# Altium schematic sheet MB1209.SchDoc: MB1209-TOP
size A3; Date: 3/31/2015; Author: P.A.; CompanyName: STMicroelectronics; Organization: Microcontrollers Division; Address1: 12, Rue Jules HOROWITZ; Address2: 38019 Grenoble; Address3: FRANCE; DocumentNumber: MB1209; Revision: D-02; SheetNumber: 1; SheetTotal: 11; Project: STM32F412G-DISCO; ModifiedDate: 6/2/2016
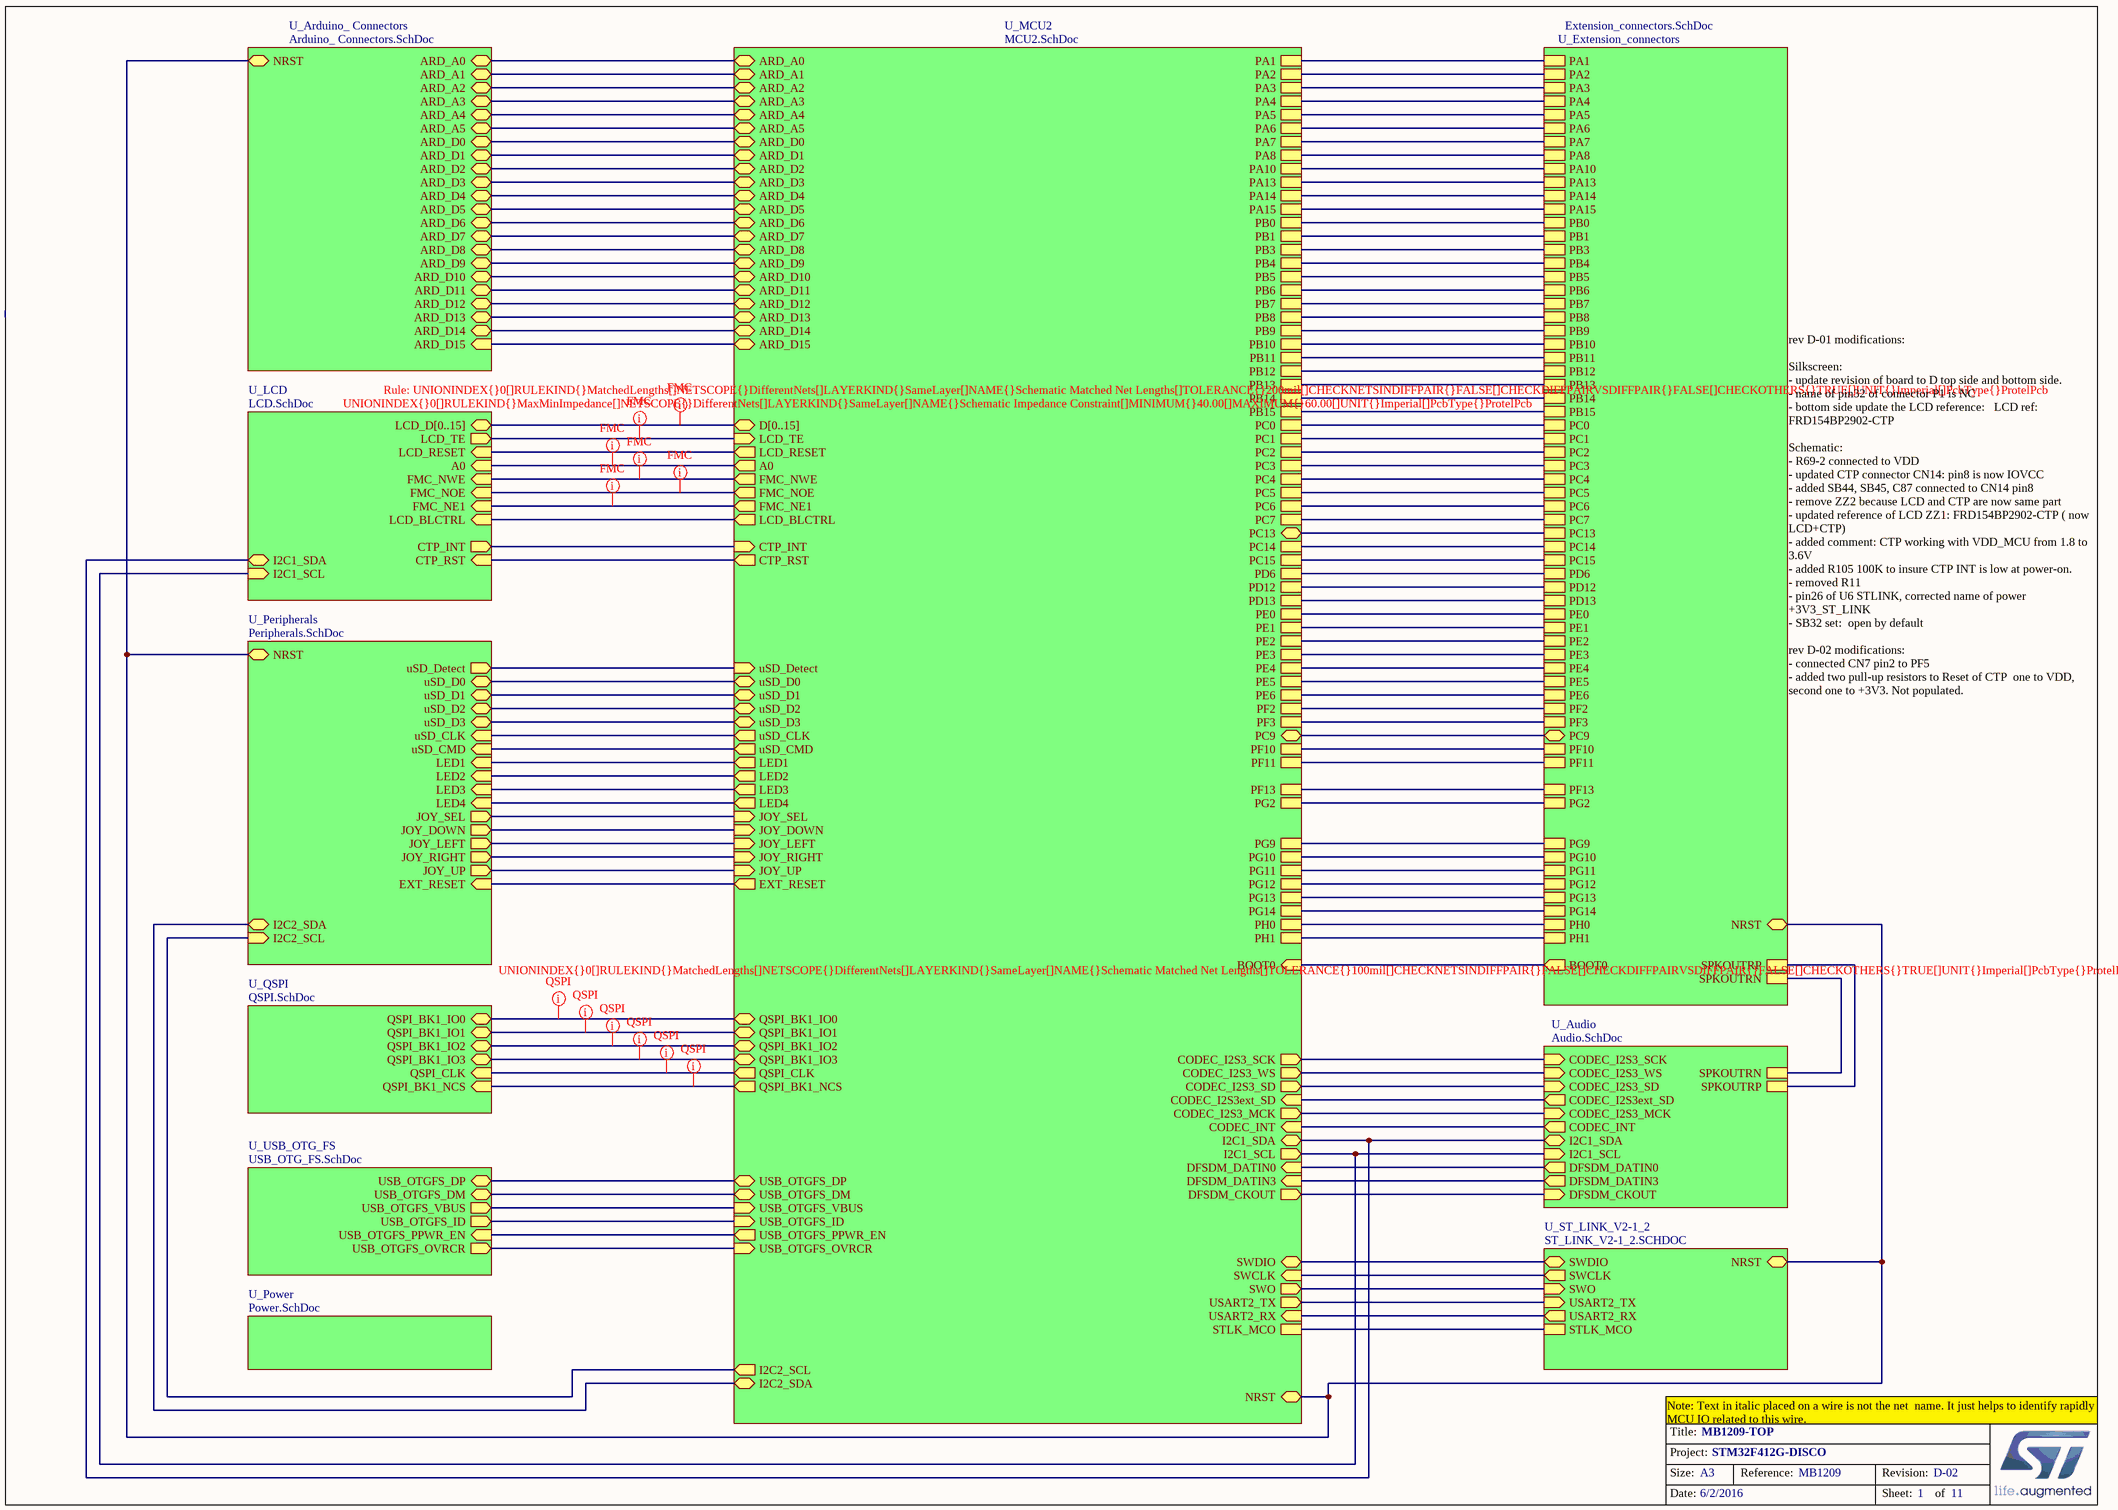
[diagram p0: MB1209.SchDoc]

## Sub-sheets
U_Arduino_ Connectors = Arduino_ Connectors.SchDoc: NRST (bidir), ARD_A0 (bidir), ARD_A1 (bidir), ARD_A2 (bidir), ARD_A3 (bidir), ARD_A4 (bidir), ARD_A5 (bidir), ARD_D5 (bidir), ARD_D4 (bidir), ARD_D3 (bidir), ARD_D2 (bidir), ARD_D1 (bidir), ARD_D0 (bidir), ARD_D13 (bidir), ARD_D12 (bidir), ARD_D11 (bidir), ARD_D10 (bidir), ARD_D9 (bidir), ARD_D8 (bidir), ARD_D6 (bidir), ARD_D7 (bidir), ARD_D15 (in), ARD_D14 (bidir)
U_Audio = Audio.SchDoc: CODEC_INT (out), DFSDM_DATIN0 (out), DFSDM_CKOUT (in), SPKOUTRN, SPKOUTRP, DFSDM_DATIN3 (out), CODEC_I2S3_SCK (in), CODEC_I2S3_WS (in), CODEC_I2S3_SD (in), I2C1_SCL (in), CODEC_I2S3_MCK (in), I2C1_SDA (bidir), CODEC_I2S3ext_SD (out)
U_Extension_connectors = Extension_connectors.SchDoc: PC0, PC2, PA4, PA6, PC4, PB0, PB10, PB12, PB14, PD12, PC1, PC3, PA1, PA7, PC5, PB1, PA5, PB11, PB13, PB15, PD13, PH1, PC15, PC13, PE1, PB7, PB5, PB3, PE5, PE3, PB9, PD6, PA13, PA15, PC7, PH0, PC14, PE6, PE4, PE2, PE0, PB8, PB6, PA14, PA10, PA8, PB4, PC6, PA2, PA3, PF2, PF3, PF10, PF11, PF13, PG2, PG9, PG10, PG11, PG12, PG13, PG14, SPKOUTRN, SPKOUTRP, BOOT0 (out), NRST, PC9 (bidir)
U_LCD = LCD.SchDoc: LCD_RESET (in), A0 (in), FMC_NWE (in), FMC_NOE (in), FMC_NE1 (in), LCD_TE (out), LCD_BLCTRL (in), LCD_D[0..15] (bidir), I2C1_SDA (bidir), I2C1_SCL (in), CTP_INT (out), CTP_RST (in)
U_MCU2 = MCU2.SchDoc: uSD_D0 (bidir), uSD_D1 (bidir), uSD_D2 (bidir), uSD_D3 (bidir), uSD_CLK (out), uSD_CMD (out), D[0..15] (bidir), A0 (out), NRST (bidir), QSPI_BK1_IO3 (bidir), FMC_NOE (out), FMC_NWE (out), LED3 (out), LED4 (out), QSPI_BK1_IO2 (bidir), QSPI_BK1_IO0 (bidir), QSPI_BK1_IO1 (bidir), uSD_Detect (in), USB_OTGFS_VBUS (in), USB_OTGFS_ID (in), USB_OTGFS_DM (bidir), DFSDM_DATIN0 (in), QSPI_CLK (out), DFSDM_CKOUT (out), FMC_NE1 (out), LCD_RESET (out), LED1 (out), LED2 (out), JOY_RIGHT (in), JOY_LEFT (in), JOY_UP (in), JOY_DOWN (in), QSPI_BK1_NCS (out), USB_OTGFS_OVRCR (in), USB_OTGFS_PPWR_EN (out), SWO (out), SWDIO (bidir), SWCLK (in), USART2_TX (out), USART2_RX (in), EXT_RESET (out), PH0, PH1, STLK_MCO, JOY_SEL (in), CODEC_INT (in), LCD_TE (in), LCD_BLCTRL (out), PC0, PC2, PD12, PC1, PC3, PD13, PE6, PE4, PE2, PE0, PE1, PE5, PE3, PD6, PA4, PA6, PA2, PA1, PA7, PA5, PA3, PA14, PA10, PA8, PA13, PA15, PB10, PB12, PB14, PB11, PB13, PB15, PB8, PB6, PB4, PB7, PB5, PB3, PB9, PC4, PC5, PC14, PC6, PC15, PC7, PB1, PB0, PF2, PF3, PF10, PF11, PF13, PG2, PG9, PG10, PG11, PG12, PG13, PG14, I2C2_SDA (bidir), I2C2_SCL (out), USB_OTGFS_DP (bidir), PC13, BOOT0 (in), DFSDM_DATIN3 (in), I2C1_SCL (out), I2C1_SDA (bidir), CODEC_I2S3_WS (out), CODEC_I2S3_SCK (out), CODEC_I2S3_SD (out), CODEC_I2S3_MCK (out), CODEC_I2S3ext_SD (in), CTP_INT (in), ARD_D3 (bidir), CTP_RST (out), ARD_D5, ARD_D4, ARD_A0, ARD_D2, ARD_D1, ARD_D0, ARD_D8, ARD_D7, ARD_A1, ARD_A2, ARD_A3, ARD_A4, ARD_D12, ARD_D13, ARD_D11, ARD_D10, ARD_A5, ARD_D15, ARD_D14, ARD_D9, ARD_D6, PC9 (bidir)
U_Peripherals = Peripherals.SchDoc: uSD_CLK (in), uSD_CMD (in), uSD_D0 (bidir), uSD_D1 (bidir), uSD_D2 (bidir), uSD_D3 (bidir), uSD_Detect (out), EXT_RESET (in), LED1 (in), LED2 (in), LED3 (in), LED4 (in), NRST (bidir), I2C2_SDA (bidir), I2C2_SCL (in), JOY_SEL (out), JOY_DOWN (out), JOY_LEFT (out), JOY_RIGHT (out), JOY_UP (out)
U_Power = Power.SchDoc: no entries
U_QSPI = QSPI.SchDoc: QSPI_BK1_IO0 (bidir), QSPI_BK1_IO2 (bidir), QSPI_BK1_IO1 (bidir), QSPI_BK1_IO3 (bidir), QSPI_CLK (in), QSPI_BK1_NCS (in)
U_ST_LINK_V2-1_2 = ST_LINK_V2-1_2.SCHDOC: STLK_MCO, NRST (bidir), SWCLK (out), SWDIO (bidir), SWO (in), USART2_TX (in), USART2_RX (out)
U_USB_OTG_FS = USB_OTG_FS.SchDoc: USB_OTGFS_VBUS (out), USB_OTGFS_DM (bidir), USB_OTGFS_DP (bidir), USB_OTGFS_ID (out), USB_OTGFS_OVRCR (out), USB_OTGFS_PPWR_EN (in)

## Nets
(unnamed): sheet U_MCU2/uSD_D0, sheet U_Peripherals/uSD_D0
(unnamed): sheet U_MCU2/uSD_D1, sheet U_Peripherals/uSD_D1
(unnamed): sheet U_MCU2/uSD_D2, sheet U_Peripherals/uSD_D2
(unnamed): sheet U_MCU2/uSD_D3, sheet U_Peripherals/uSD_D3
(unnamed): sheet U_MCU2/uSD_CLK, sheet U_Peripherals/uSD_CLK
(unnamed): sheet U_MCU2/uSD_CMD, sheet U_Peripherals/uSD_CMD
(unnamed): sheet U_MCU2/A0, sheet U_LCD/A0
(unnamed): sheet U_MCU2/NRST, sheet U_Extension_connectors/NRST, sheet U_Arduino_ Connectors/NRST, sheet U_Peripherals/NRST, sheet U_ST_LINK_V2-1_2/NRST
(unnamed): sheet U_MCU2/QSPI_BK1_IO3, sheet U_QSPI/QSPI_BK1_IO3
(unnamed): sheet U_MCU2/FMC_NOE, sheet U_LCD/FMC_NOE
(unnamed): sheet U_MCU2/FMC_NWE, sheet U_LCD/FMC_NWE
(unnamed): sheet U_MCU2/LED3, sheet U_Peripherals/LED3
(unnamed): sheet U_MCU2/LED4, sheet U_Peripherals/LED4
(unnamed): sheet U_MCU2/QSPI_BK1_IO2, sheet U_QSPI/QSPI_BK1_IO2
(unnamed): sheet U_MCU2/QSPI_BK1_IO0, sheet U_QSPI/QSPI_BK1_IO0
(unnamed): sheet U_MCU2/QSPI_BK1_IO1, sheet U_QSPI/QSPI_BK1_IO1
(unnamed): sheet U_MCU2/uSD_Detect, sheet U_Peripherals/uSD_Detect
(unnamed): sheet U_MCU2/USB_OTGFS_VBUS, sheet U_USB_OTG_FS/USB_OTGFS_VBUS
(unnamed): sheet U_MCU2/USB_OTGFS_ID, sheet U_USB_OTG_FS/USB_OTGFS_ID
(unnamed): sheet U_MCU2/USB_OTGFS_DM, sheet U_USB_OTG_FS/USB_OTGFS_DM
(unnamed): sheet U_MCU2/DFSDM_DATIN0, sheet U_Audio/DFSDM_DATIN0
(unnamed): sheet U_MCU2/QSPI_CLK, sheet U_QSPI/QSPI_CLK
(unnamed): sheet U_MCU2/DFSDM_CKOUT, sheet U_Audio/DFSDM_CKOUT
(unnamed): sheet U_MCU2/FMC_NE1, sheet U_LCD/FMC_NE1
(unnamed): sheet U_MCU2/LCD_RESET, sheet U_LCD/LCD_RESET
(unnamed): sheet U_MCU2/LED1, sheet U_Peripherals/LED1
(unnamed): sheet U_MCU2/LED2, sheet U_Peripherals/LED2
(unnamed): sheet U_MCU2/JOY_RIGHT, sheet U_Peripherals/JOY_RIGHT
(unnamed): sheet U_MCU2/JOY_LEFT, sheet U_Peripherals/JOY_LEFT
(unnamed): sheet U_MCU2/JOY_UP, sheet U_Peripherals/JOY_UP
(unnamed): sheet U_MCU2/JOY_DOWN, sheet U_Peripherals/JOY_DOWN
(unnamed): sheet U_MCU2/QSPI_BK1_NCS, sheet U_QSPI/QSPI_BK1_NCS
(unnamed): sheet U_MCU2/USB_OTGFS_OVRCR, sheet U_USB_OTG_FS/USB_OTGFS_OVRCR
(unnamed): sheet U_MCU2/USB_OTGFS_PPWR_EN, sheet U_USB_OTG_FS/USB_OTGFS_PPWR_EN
(unnamed): sheet U_MCU2/SWO, sheet U_ST_LINK_V2-1_2/SWO
(unnamed): sheet U_MCU2/SWDIO, sheet U_ST_LINK_V2-1_2/SWDIO
(unnamed): sheet U_MCU2/SWCLK, sheet U_ST_LINK_V2-1_2/SWCLK
(unnamed): sheet U_MCU2/USART2_TX, sheet U_ST_LINK_V2-1_2/USART2_TX
(unnamed): sheet U_MCU2/USART2_RX, sheet U_ST_LINK_V2-1_2/USART2_RX
(unnamed): sheet U_MCU2/EXT_RESET, sheet U_Peripherals/EXT_RESET
(unnamed): sheet U_MCU2/PH0, sheet U_Extension_connectors/PH0
(unnamed): sheet U_MCU2/PH1, sheet U_Extension_connectors/PH1
(unnamed): sheet U_MCU2/STLK_MCO, sheet U_ST_LINK_V2-1_2/STLK_MCO
(unnamed): sheet U_MCU2/JOY_SEL, sheet U_Peripherals/JOY_SEL
(unnamed): sheet U_MCU2/CODEC_INT, sheet U_Audio/CODEC_INT
(unnamed): sheet U_MCU2/LCD_TE, sheet U_LCD/LCD_TE
(unnamed): sheet U_MCU2/LCD_BLCTRL, sheet U_LCD/LCD_BLCTRL
(unnamed): sheet U_MCU2/PC0, sheet U_Extension_connectors/PC0
(unnamed): sheet U_MCU2/PC2, sheet U_Extension_connectors/PC2
(unnamed): sheet U_MCU2/PD12, sheet U_Extension_connectors/PD12
(unnamed): sheet U_MCU2/PC1, sheet U_Extension_connectors/PC1
(unnamed): sheet U_MCU2/PC3, sheet U_Extension_connectors/PC3
(unnamed): sheet U_MCU2/PD13, sheet U_Extension_connectors/PD13
(unnamed): sheet U_MCU2/PE6, sheet U_Extension_connectors/PE6
(unnamed): sheet U_MCU2/PE4, sheet U_Extension_connectors/PE4
(unnamed): sheet U_MCU2/PE2, sheet U_Extension_connectors/PE2
(unnamed): sheet U_MCU2/PE0, sheet U_Extension_connectors/PE0
(unnamed): sheet U_MCU2/PE1, sheet U_Extension_connectors/PE1
(unnamed): sheet U_MCU2/PE5, sheet U_Extension_connectors/PE5
(unnamed): sheet U_MCU2/PE3, sheet U_Extension_connectors/PE3
(unnamed): sheet U_MCU2/PD6, sheet U_Extension_connectors/PD6
(unnamed): sheet U_MCU2/PA4, sheet U_Extension_connectors/PA4
(unnamed): sheet U_MCU2/PA6, sheet U_Extension_connectors/PA6
(unnamed): sheet U_MCU2/PA2, sheet U_Extension_connectors/PA2
(unnamed): sheet U_MCU2/PA1, sheet U_Extension_connectors/PA1
(unnamed): sheet U_MCU2/PA7, sheet U_Extension_connectors/PA7
(unnamed): sheet U_MCU2/PA5, sheet U_Extension_connectors/PA5
(unnamed): sheet U_MCU2/PA3, sheet U_Extension_connectors/PA3
(unnamed): sheet U_MCU2/PA14, sheet U_Extension_connectors/PA14
(unnamed): sheet U_MCU2/PA10, sheet U_Extension_connectors/PA10
(unnamed): sheet U_MCU2/PA8, sheet U_Extension_connectors/PA8
(unnamed): sheet U_MCU2/PA13, sheet U_Extension_connectors/PA13
(unnamed): sheet U_MCU2/PA15, sheet U_Extension_connectors/PA15
(unnamed): sheet U_MCU2/PB10, sheet U_Extension_connectors/PB10
(unnamed): sheet U_MCU2/PB12, sheet U_Extension_connectors/PB12
(unnamed): sheet U_MCU2/PB14, sheet U_Extension_connectors/PB14
(unnamed): sheet U_MCU2/PB11, sheet U_Extension_connectors/PB11
(unnamed): sheet U_MCU2/PB13, sheet U_Extension_connectors/PB13
(unnamed): sheet U_MCU2/PB15, sheet U_Extension_connectors/PB15
(unnamed): sheet U_MCU2/PB8, sheet U_Extension_connectors/PB8
(unnamed): sheet U_MCU2/PB6, sheet U_Extension_connectors/PB6
(unnamed): sheet U_MCU2/PB4, sheet U_Extension_connectors/PB4
(unnamed): sheet U_MCU2/PB7, sheet U_Extension_connectors/PB7
(unnamed): sheet U_MCU2/PB5, sheet U_Extension_connectors/PB5
(unnamed): sheet U_MCU2/PB3, sheet U_Extension_connectors/PB3
(unnamed): sheet U_MCU2/PB9, sheet U_Extension_connectors/PB9
(unnamed): sheet U_MCU2/PC4, sheet U_Extension_connectors/PC4
(unnamed): sheet U_MCU2/PC5, sheet U_Extension_connectors/PC5
(unnamed): sheet U_MCU2/PC14, sheet U_Extension_connectors/PC14
(unnamed): sheet U_MCU2/PC6, sheet U_Extension_connectors/PC6
(unnamed): sheet U_MCU2/PC15, sheet U_Extension_connectors/PC15
(unnamed): sheet U_MCU2/PC7, sheet U_Extension_connectors/PC7
(unnamed): sheet U_MCU2/PB1, sheet U_Extension_connectors/PB1
(unnamed): sheet U_MCU2/PB0, sheet U_Extension_connectors/PB0
(unnamed): sheet U_MCU2/PF2, sheet U_Extension_connectors/PF2
(unnamed): sheet U_MCU2/PF3, sheet U_Extension_connectors/PF3
(unnamed): sheet U_MCU2/PF10, sheet U_Extension_connectors/PF10
(unnamed): sheet U_MCU2/PF11, sheet U_Extension_connectors/PF11
(unnamed): sheet U_MCU2/PF13, sheet U_Extension_connectors/PF13
(unnamed): sheet U_MCU2/PG2, sheet U_Extension_connectors/PG2
(unnamed): sheet U_MCU2/PG9, sheet U_Extension_connectors/PG9
(unnamed): sheet U_MCU2/PG10, sheet U_Extension_connectors/PG10
(unnamed): sheet U_MCU2/PG11, sheet U_Extension_connectors/PG11
(unnamed): sheet U_MCU2/PG12, sheet U_Extension_connectors/PG12
(unnamed): sheet U_MCU2/PG13, sheet U_Extension_connectors/PG13
(unnamed): sheet U_MCU2/PG14, sheet U_Extension_connectors/PG14
(unnamed): sheet U_MCU2/I2C2_SDA, sheet U_Peripherals/I2C2_SDA
(unnamed): sheet U_MCU2/I2C2_SCL, sheet U_Peripherals/I2C2_SCL
(unnamed): sheet U_MCU2/USB_OTGFS_DP, sheet U_USB_OTG_FS/USB_OTGFS_DP
(unnamed): sheet U_MCU2/PC13, sheet U_Extension_connectors/PC13
(unnamed): sheet U_MCU2/BOOT0, sheet U_Extension_connectors/BOOT0
(unnamed): sheet U_MCU2/DFSDM_DATIN3, sheet U_Audio/DFSDM_DATIN3
(unnamed): sheet U_MCU2/I2C1_SCL, sheet U_Audio/I2C1_SCL, sheet U_LCD/I2C1_SCL
(unnamed): sheet U_MCU2/I2C1_SDA, sheet U_Audio/I2C1_SDA, sheet U_LCD/I2C1_SDA
(unnamed): sheet U_MCU2/CODEC_I2S3_WS, sheet U_Audio/CODEC_I2S3_WS
(unnamed): sheet U_MCU2/CODEC_I2S3_SCK, sheet U_Audio/CODEC_I2S3_SCK
(unnamed): sheet U_MCU2/CODEC_I2S3_SD, sheet U_Audio/CODEC_I2S3_SD
(unnamed): sheet U_MCU2/CODEC_I2S3_MCK, sheet U_Audio/CODEC_I2S3_MCK
(unnamed): sheet U_MCU2/CODEC_I2S3ext_SD, sheet U_Audio/CODEC_I2S3ext_SD
(unnamed): sheet U_MCU2/CTP_INT, sheet U_LCD/CTP_INT
(unnamed): sheet U_MCU2/ARD_D3, sheet U_Arduino_ Connectors/ARD_D3
(unnamed): sheet U_MCU2/CTP_RST, sheet U_LCD/CTP_RST
(unnamed): sheet U_MCU2/ARD_D5, sheet U_Arduino_ Connectors/ARD_D5
(unnamed): sheet U_MCU2/ARD_D4, sheet U_Arduino_ Connectors/ARD_D4
(unnamed): sheet U_MCU2/ARD_A0, sheet U_Arduino_ Connectors/ARD_A0
(unnamed): sheet U_MCU2/ARD_D2, sheet U_Arduino_ Connectors/ARD_D2
(unnamed): sheet U_MCU2/ARD_D1, sheet U_Arduino_ Connectors/ARD_D1
(unnamed): sheet U_MCU2/ARD_D0, sheet U_Arduino_ Connectors/ARD_D0
(unnamed): sheet U_MCU2/ARD_D8, sheet U_Arduino_ Connectors/ARD_D8
(unnamed): sheet U_MCU2/ARD_D7, sheet U_Arduino_ Connectors/ARD_D7
(unnamed): sheet U_MCU2/ARD_A1, sheet U_Arduino_ Connectors/ARD_A1
(unnamed): sheet U_MCU2/ARD_A2, sheet U_Arduino_ Connectors/ARD_A2
(unnamed): sheet U_MCU2/ARD_A3, sheet U_Arduino_ Connectors/ARD_A3
(unnamed): sheet U_MCU2/ARD_A4, sheet U_Arduino_ Connectors/ARD_A4
(unnamed): sheet U_MCU2/ARD_D12, sheet U_Arduino_ Connectors/ARD_D12
(unnamed): sheet U_MCU2/ARD_D13, sheet U_Arduino_ Connectors/ARD_D13
(unnamed): sheet U_MCU2/ARD_D11, sheet U_Arduino_ Connectors/ARD_D11
(unnamed): sheet U_MCU2/ARD_D10, sheet U_Arduino_ Connectors/ARD_D10
(unnamed): sheet U_MCU2/ARD_A5, sheet U_Arduino_ Connectors/ARD_A5
(unnamed): sheet U_MCU2/ARD_D15, sheet U_Arduino_ Connectors/ARD_D15
(unnamed): sheet U_MCU2/ARD_D14, sheet U_Arduino_ Connectors/ARD_D14
(unnamed): sheet U_MCU2/ARD_D9, sheet U_Arduino_ Connectors/ARD_D9
(unnamed): sheet U_MCU2/ARD_D6, sheet U_Arduino_ Connectors/ARD_D6
(unnamed): sheet U_MCU2/PC9, sheet U_Extension_connectors/PC9
(unnamed): sheet U_Extension_connectors/SPKOUTRN, sheet U_Audio/SPKOUTRN
(unnamed): sheet U_Extension_connectors/SPKOUTRP, sheet U_Audio/SPKOUTRP

## Buses and harness runs
bus sheet U_LCD/LCD_D[0..15] = sheet U_MCU2/D[0..15]

## Layout directives
rule Matched Net Lengths [Tolerance = 200mil]; rule ? ; rule Impedance Constraint [Min = 40.00    Max = 60.00    ]: (no net found under the mark)
rule Matched Net Lengths [Tolerance = 200mil]; rule Impedance Constraint [Min = 40.00    Max = 60.00    ]: (no net found under the mark)
rule Matched Net Lengths [Tolerance = 100mil]: (no net found under the mark)

## Notes on the sheet
- rev D-01 modifications:
  Silkscreen:
  - update revision of board to D top side and bottom side.
  - name of pin32 of connector P1 is NC
  - bottom side update the LCD reference:   LCD ref: FRD154BP2902-CTP
  Schematic:
  - R69-2 connected to VDD
  - updated CTP connector CN14: pin8 is now IOVCC
  - added SB44, SB45, C87 connected to CN14 pin8
  - remove ZZ2 because LCD and CTP are now same part
  - updated reference of LCD ZZ1: FRD154BP2902-CTP ( now LCD+CTP)
  - added comment: CTP working with VDD_MCU from 1.8 to 3.6V
  - added R105 100K to insure CTP INT is low at power-on.
  - removed R11
  - pin26 of U6 STLINK, corrected name of power +3V3_ST_LINK
  - SB32 set:  open by default
  rev D-02 modifications:
  - connected CN7 pin2 to PF5
  - added two pull-up resistors to Reset of CTP  one to VDD, second one to +3V3. Not populated.
- Note: Text in italic placed on a wire is not the net  name. It just helps to identify rapidly MCU IO related to this wire.
- Title:
- Project:
- Size:
- Date:
- A3
- Reference:
- Sheet:
- Revision:
- of